# EAGLE design dual-dac-w-32-ch-sh-SH-BOARD v2 (EAGLE 7.2.0)
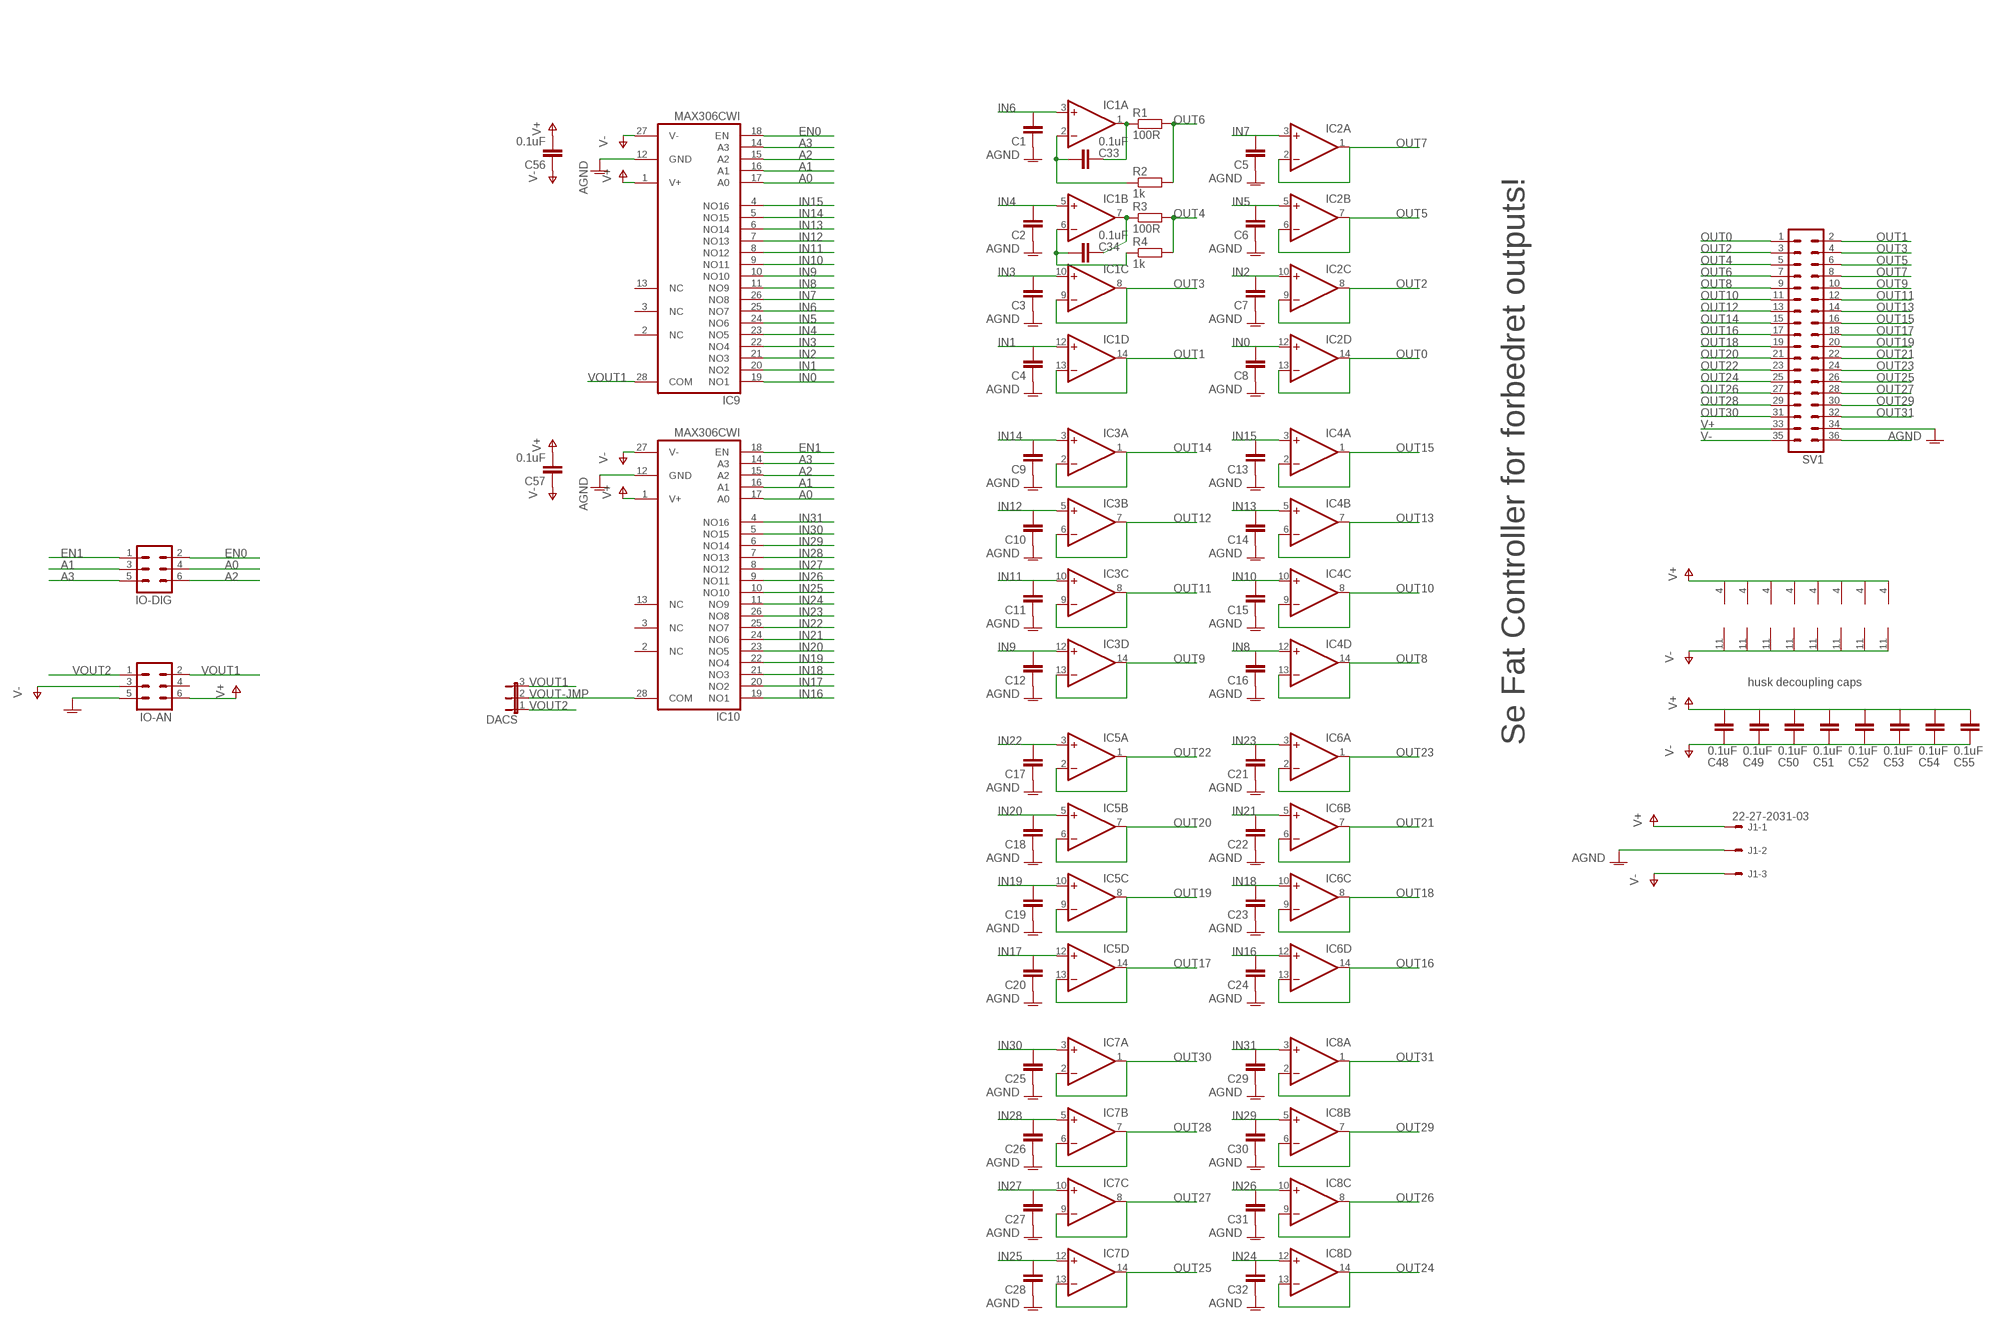
[diagram p0: schematic, sheet 1]

## Parts
C1  C-EUC1206  [C1206]
C2  C-EUC1206  [C1206]
C3  C-EUC1206  [C1206]
C4  C-EUC1206  [C1206]
C5  C-EUC1206  [C1206]
C6  C-EUC1206  [C1206]
C7  C-EUC1206  [C1206]
C8  C-EUC1206  [C1206]
C9  C-EUC1206  [C1206]
C10  C-EUC1206  [C1206]
C11  C-EUC1206  [C1206]
C12  C-EUC1206  [C1206]
C13  C-EUC1206  [C1206]
C14  C-EUC1206  [C1206]
C15  C-EUC1206  [C1206]
C16  C-EUC1206  [C1206]
C17  C-EUC1206  [C1206]
C18  C-EUC1206  [C1206]
C19  C-EUC1206  [C1206]
C20  C-EUC1206  [C1206]
C21  C-EUC1206  [C1206]
C22  C-EUC1206  [C1206]
C23  C-EUC1206  [C1206]
C24  C-EUC1206  [C1206]
C25  C-EUC1206  [C1206]
C26  C-EUC1206  [C1206]
C27  C-EUC1206  [C1206]
C28  C-EUC1206  [C1206]
C29  C-EUC1206  [C1206]
C30  C-EUC1206  [C1206]
C31  C-EUC1206  [C1206]
C32  C-EUC1206  [C1206]
C33  0.1uF  C-EUC0603  [C0603]
C34  0.1uF  C-EUC0603  [C0603]
C48  0.1uF  C-EUC0603  [C0603]
C49  0.1uF  C-EUC0603  [C0603]
C50  0.1uF  C-EUC0603  [C0603]
C51  0.1uF  C-EUC0603  [C0603]
C52  0.1uF  C-EUC0603  [C0603]
C53  0.1uF  C-EUC0603  [C0603]
C54  0.1uF  C-EUC0603  [C0603]
C55  0.1uF  C-EUC0603  [C0603]
C56  0.1uF  C-EUC0603  [C0603]
C57  0.1uF  C-EUC0603  [C0603]
DACS  JP2E  [JP2]
IC1  TL074D  [SO14]
IC2  TL074D  [SO14]
IC3  TL074D  [SO14]
IC4  TL074D  [SO14]
IC5  TL074D  [SO14]
IC6  TL074D  [SO14]
IC7  TL074D  [SO14]
IC8  TL074D  [SO14]
IC9  MAX306CWI  [SO28L]
IC10  MAX306CWI  [SO28L]
IO-AN  MA03-2  [MA03-2]
IO-DIG  MA03-2  [MA03-2]
J1  22-27-2031-03  [6410-03]
R1  100R  R-EU_R0603  [R0603]
R2  1k  R-EU_R0603  [R0603]
R3  100R  R-EU_R0603  [R0603]
R4  1k  R-EU_R0603  [R0603]
SV1  MA18-2  [MA18-2]

## Nets
A0: IC9.17(A0) IC10.17(A0) IO-DIG.4
A1: IC9.16(A1) IC10.16(A1) IO-DIG.3
A2: IC9.15(A2) IC10.15(A2) IO-DIG.6
A3: IC9.14(A3) IC10.14(A3) IO-DIG.5
AGND: C1.1 C2.1 C3.1 C4.1 C5.1 C6.1 C7.1 C8.1 C9.1 C10.1 C11.1 C12.1 C13.1 C14.1 C15.1 C16.1 C17.1 C18.1 C19.1 C20.1 C21.1 C22.1 C23.1 C24.1 C25.1 C26.1 C27.1 C28.1 C29.1 C30.1 C31.1 C32.1 IC9.12(GND) IC10.12(GND) IO-AN.5 J1.2 SV1.34
EN0: IC9.18(EN) IO-DIG.2
EN1: IC10.18(EN) IO-DIG.1
IN0: C8.2 IC2.12(D:+IN) IC9.19(NO1)
IN1: C4.2 IC1.12(D:+IN) IC9.20(NO2)
IN2: C7.2 IC2.10(C:+IN) IC9.21(NO3)
IN3: C3.2 IC1.10(C:+IN) IC9.22(NO4)
IN4: C2.2 IC1.5(B:+IN) IC9.23(NO5)
IN5: C6.2 IC2.5(B:+IN) IC9.24(NO6)
IN6: C1.2 IC1.3(A:+IN) IC9.25(NO7)
IN7: C5.2 IC2.3(A:+IN) IC9.26(NO8)
IN8: C16.2 IC4.12(D:+IN) IC9.11(NO9)
IN9: C12.2 IC3.12(D:+IN) IC9.10(NO10)
IN10: C15.2 IC4.10(C:+IN) IC9.9(NO11)
IN11: C11.2 IC3.10(C:+IN) IC9.8(NO12)
IN12: C10.2 IC3.5(B:+IN) IC9.7(NO13)
IN13: C14.2 IC4.5(B:+IN) IC9.6(NO14)
IN14: C9.2 IC3.3(A:+IN) IC9.5(NO15)
IN15: C13.2 IC4.3(A:+IN) IC9.4(NO16)
IN16: C24.2 IC6.12(D:+IN) IC10.19(NO1)
IN17: C20.2 IC5.12(D:+IN) IC10.20(NO2)
IN18: C23.2 IC6.10(C:+IN) IC10.21(NO3)
IN19: C19.2 IC5.10(C:+IN) IC10.22(NO4)
IN20: C18.2 IC5.5(B:+IN) IC10.23(NO5)
IN21: C22.2 IC6.5(B:+IN) IC10.24(NO6)
IN22: C17.2 IC5.3(A:+IN) IC10.25(NO7)
IN23: C21.2 IC6.3(A:+IN) IC10.26(NO8)
IN24: C32.2 IC8.12(D:+IN) IC10.11(NO9)
IN25: C28.2 IC7.12(D:+IN) IC10.10(NO10)
IN26: C31.2 IC8.10(C:+IN) IC10.9(NO11)
IN27: C27.2 IC7.10(C:+IN) IC10.8(NO12)
IN28: C26.2 IC7.5(B:+IN) IC10.7(NO13)
IN29: C30.2 IC8.5(B:+IN) IC10.6(NO14)
IN30: C25.2 IC7.3(A:+IN) IC10.5(NO15)
IN31: C29.2 IC8.3(A:+IN) IC10.4(NO16)
N$1: C33.2 IC1.2(A:-IN) R2.1
N$2: C33.1 IC1.1(A:OUT) R1.1
N$3: C34.1 IC1.7(B:OUT) R3.1
N$4: SV1.36
N$5: C34.2 IC1.6(B:-IN) R4.1
OUT0: IC2.13(D:-IN) IC2.14(D:OUT) SV1.1
OUT1: IC1.13(D:-IN) IC1.14(D:OUT) SV1.2
OUT2: IC2.8(C:OUT) IC2.9(C:-IN) SV1.3
OUT3: IC1.8(C:OUT) IC1.9(C:-IN) SV1.4
OUT4: R3.2 R4.2 SV1.5
OUT5: IC2.6(B:-IN) IC2.7(B:OUT) SV1.6
OUT6: R1.2 R2.2 SV1.7
OUT7: IC2.1(A:OUT) IC2.2(A:-IN) SV1.8
OUT8: IC4.13(D:-IN) IC4.14(D:OUT) SV1.9
OUT9: IC3.13(D:-IN) IC3.14(D:OUT) SV1.10
OUT10: IC4.8(C:OUT) IC4.9(C:-IN) SV1.11
OUT11: IC3.8(C:OUT) IC3.9(C:-IN) SV1.12
OUT12: IC3.6(B:-IN) IC3.7(B:OUT) SV1.13
OUT13: IC4.6(B:-IN) IC4.7(B:OUT) SV1.14
OUT14: IC3.1(A:OUT) IC3.2(A:-IN) SV1.15
OUT15: IC4.1(A:OUT) IC4.2(A:-IN) SV1.16
OUT16: IC6.13(D:-IN) IC6.14(D:OUT) SV1.17
OUT17: IC5.13(D:-IN) IC5.14(D:OUT) SV1.18
OUT18: IC6.8(C:OUT) IC6.9(C:-IN) SV1.19
OUT19: IC5.8(C:OUT) IC5.9(C:-IN) SV1.20
OUT20: IC5.6(B:-IN) IC5.7(B:OUT) SV1.21
OUT21: IC6.6(B:-IN) IC6.7(B:OUT) SV1.22
OUT22: IC5.1(A:OUT) IC5.2(A:-IN) SV1.23
OUT23: IC6.1(A:OUT) IC6.2(A:-IN) SV1.24
OUT24: IC8.13(D:-IN) IC8.14(D:OUT) SV1.25
OUT25: IC7.13(D:-IN) IC7.14(D:OUT) SV1.26
OUT26: IC8.8(C:OUT) IC8.9(C:-IN) SV1.27
OUT27: IC7.8(C:OUT) IC7.9(C:-IN) SV1.28
OUT28: IC7.6(B:-IN) IC7.7(B:OUT) SV1.29
OUT29: IC8.6(B:-IN) IC8.7(B:OUT) SV1.30
OUT30: IC7.1(A:OUT) IC7.2(A:-IN) SV1.31
OUT31: IC8.1(A:OUT) IC8.2(A:-IN) SV1.32
V+: C48.2 C49.2 C50.2 C51.2 C52.2 C53.2 C54.2 C55.2 C56.2 C57.2 IC1.4(P:V+) IC2.4(P:V+) IC3.4(P:V+) IC4.4(P:V+) IC5.4(P:V+) IC6.4(P:V+) IC7.4(P:V+) IC8.4(P:V+) IC9.1(V+) IC10.1(V+) IO-AN.6 J1.1 SV1.33
V-: C48.1 C49.1 C50.1 C51.1 C52.1 C53.1 C54.1 C55.1 C56.1 C57.1 IC1.11(P:V-) IC2.11(P:V-) IC3.11(P:V-) IC4.11(P:V-) IC5.11(P:V-) IC6.11(P:V-) IC7.11(P:V-) IC8.11(P:V-) IC9.27(V-) IC10.27(V-) IO-AN.3 J1.3 SV1.35
VOUT1: DACS.3 IC9.28(COM) IO-AN.2
VOUT2: DACS.1 IO-AN.1
VOUT-JMP: DACS.2 IC10.28(COM)
Unconnected: IC9.2(NC) IC9.3(NC) IC9.13(NC) IC10.2(NC) IC10.3(NC) IC10.13(NC) IO-AN.4

## Notes on the sheet
- husk decoupling caps
- Se Fat Controller for forbedret outputs!

## Library data of the parts
C1-C34 C48-C57 = resistor:C-EU: CAPACITOR, European symbol
DACS = jumper:JP2E: JUMPER
IC1-IC8 = linear:TL074: OP AMP
IC9 IC10 = maxim:MAX306CWI: MULTIPLEXER; MF: MAXIM; MPN: MAX306CWI; OC_FARNELL: unknown; OC_NEWARK: 90C2555
IO-AN IO-DIG = con-lstb:MA03-2: PIN HEADER; OC_FARNELL: unknown; OC_NEWARK: unknown
J1 = con-molex:22-?-03: CONNECTOR wire to board 2.54 mm (.1 inch) pitch header; OC_FARNELL: unknown; OC_NEWARK: unknown
R1-R4 = resistor:R-EU_: RESISTOR, European symbol
SV1 = con-lstb:MA18-2: PIN HEADER; OC_FARNELL: unknown; OC_NEWARK: unknown

## Board
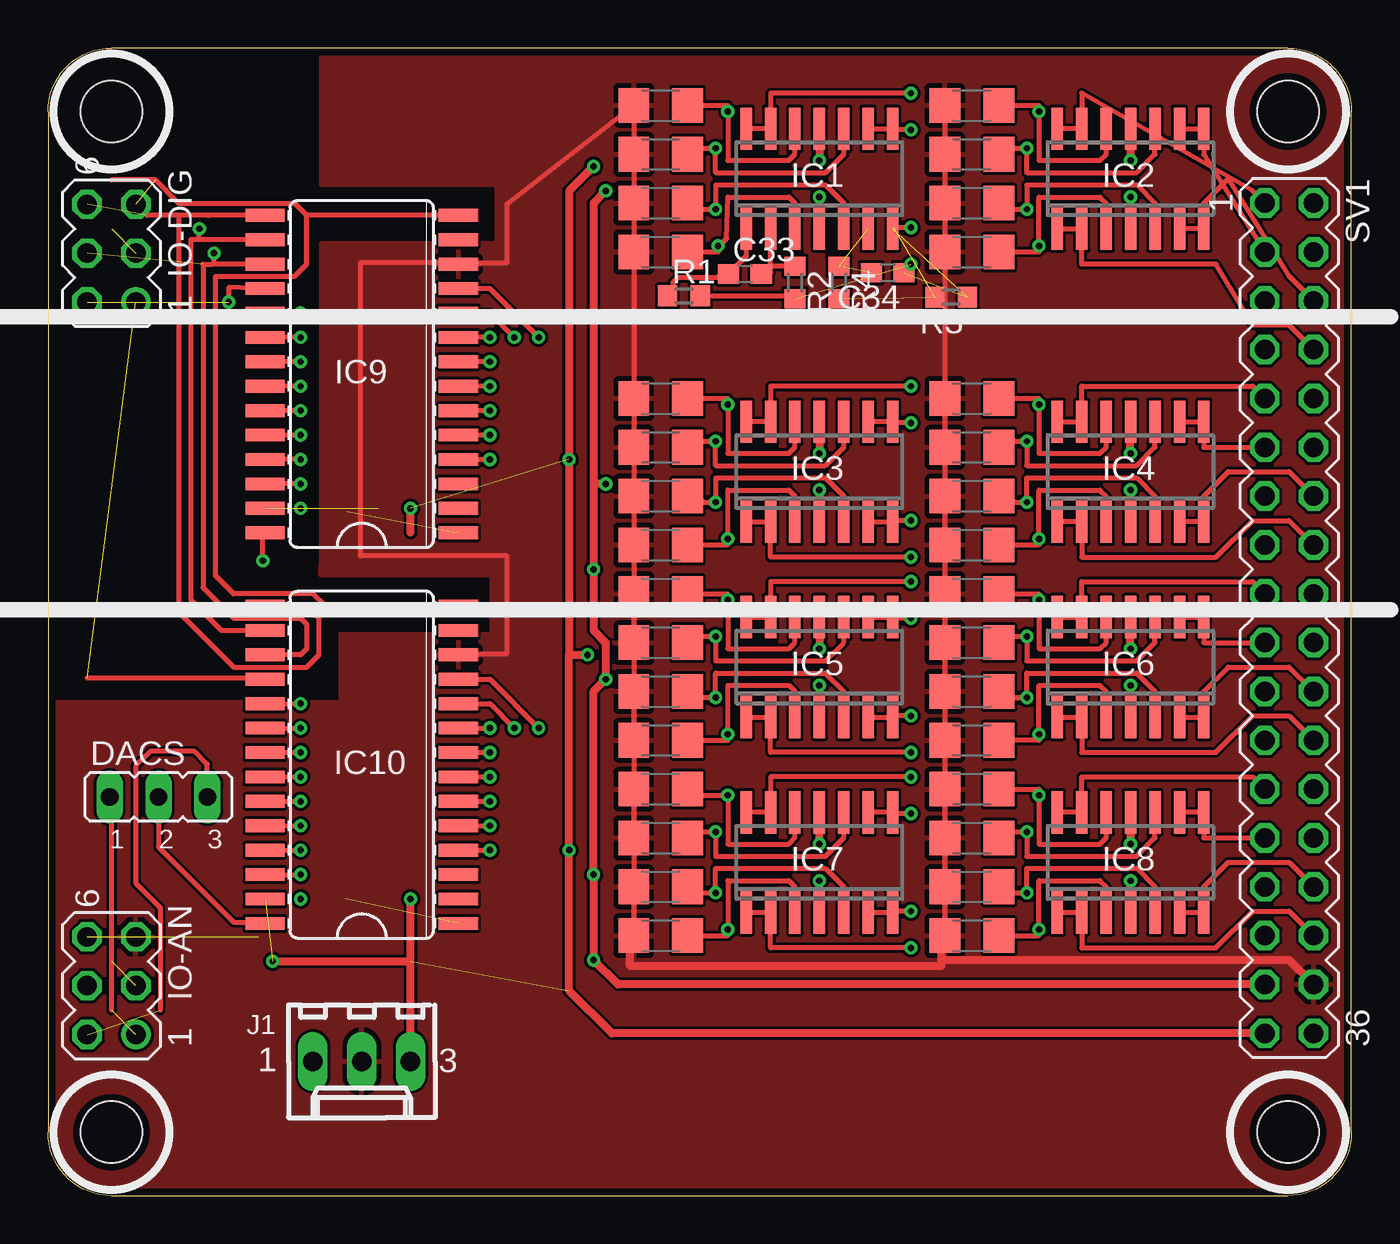
[diagram p1: board, top side]
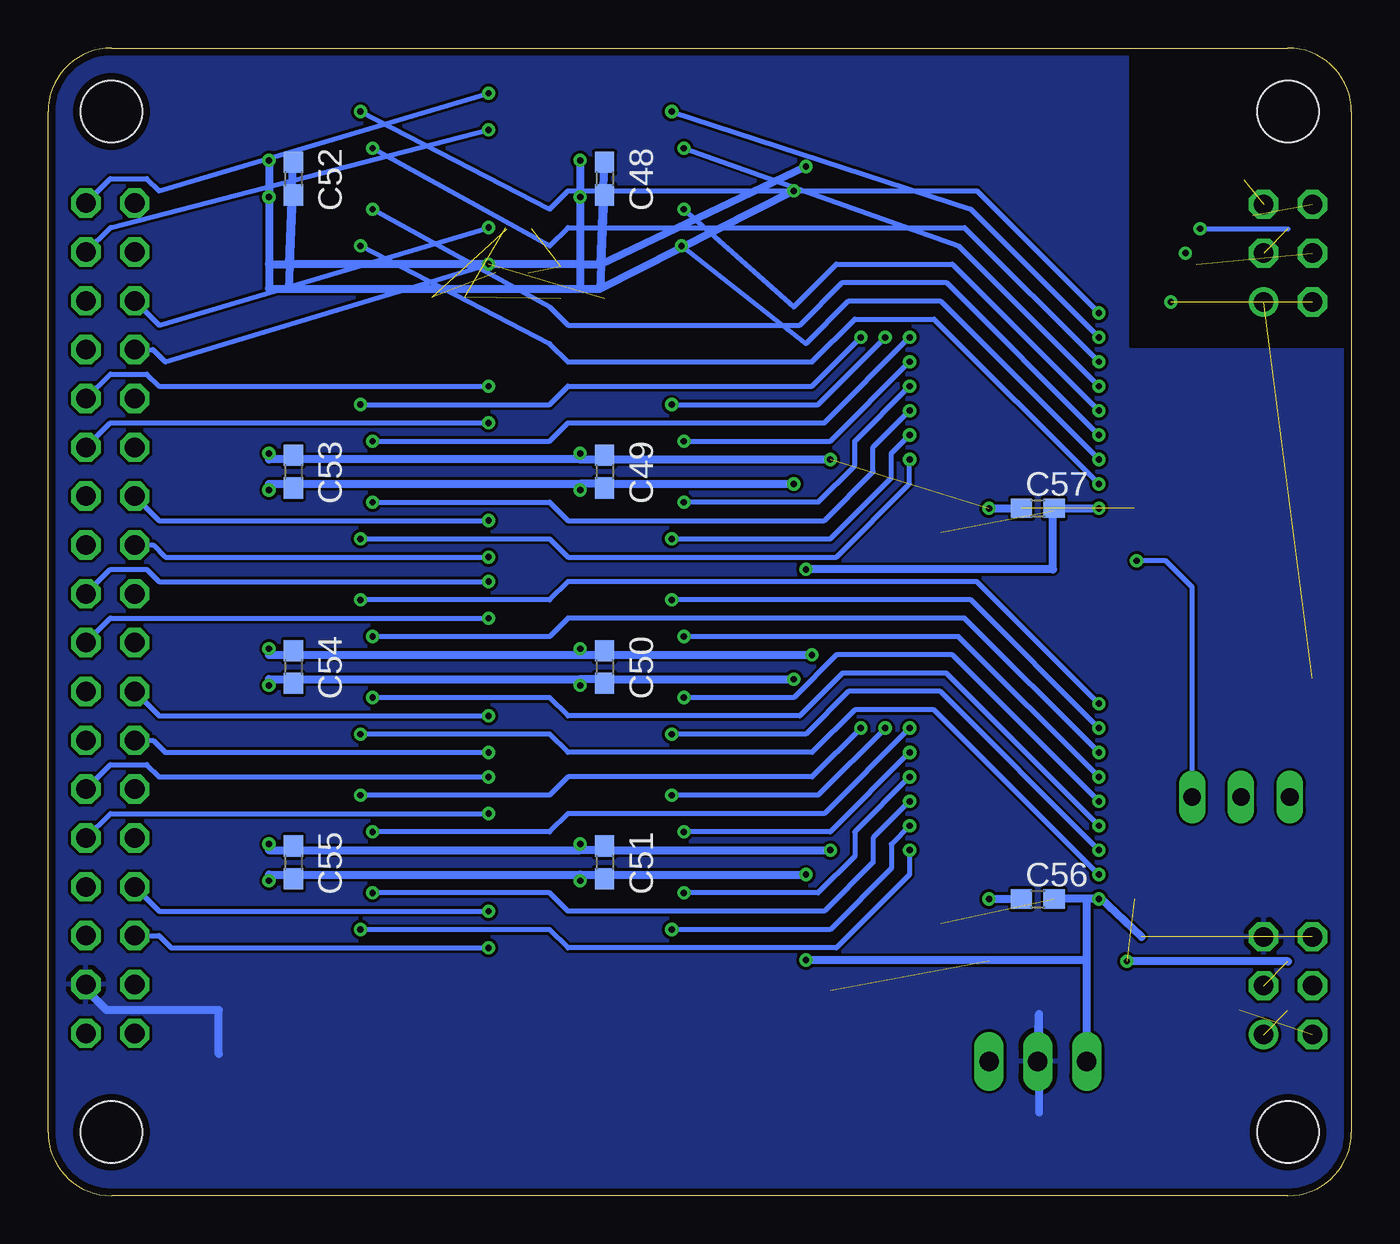
[diagram p2: board, bottom side, seen from below]

Size 67.82 x 59.69 mm. Coordinates in mm from the lower left corner, seen from the top.
Outline: 3.3,0 64.52,0 arc90 67.82,3.3 67.82,56.39 arc90 64.52,59.69 3.3,59.69 arc90 0,56.39 0,3.3 arc90 3.3,0
Copper layers (1*16): Top 0.0356mm / dielectric 1.5011mm / Bottom 0.0356mm
Design rules "LaenPCBOrder": minimum track width 6mil, minimum drill 13mil, track to track 6mil, track to pad 6mil, pad to pad 6mil, via to via 6mil, smd to smd 6mil, copper to edge 15mil, drill to drill 6mil, minimum pad ring 7mil, minimum via ring 7mil, stop-mask expansion 3mil, vias tented up to drill 0mil, thermal gap 10mil
Holes 3.2 mm at 3.3,56.39 64.52,56.39 64.52,3.3 3.3,3.3

### Footprints (pad centres in the part's own frame; a part is rotated, then mirrored left to right if it is on the bottom)
C1206 = smd 1.6 x 1.8: 1 -1.4,0; 2 1.4,0
C0603 = smd 1.1 x 1: 1 -0.85,0; 2 0.85,0
JP2 = drill 0.914 long: 1 -2.54,0; 2 0,0; 3 2.54,0
SO14 = smd 0.6 x 2.2: 1 -3.81,-2.6; 2 -2.54,-2.6; 3 -1.27,-2.6; 4 0,-2.6; 5 1.27,-2.6; 6 2.54,-2.6; 7 3.81,-2.6; 8 3.81,2.6; 9 2.54,2.6; 10 1.27,2.6; 11 0,2.6; 12 -1.27,2.6; 13 -2.54,2.6; 14 -3.81,2.6
SO28L = smd 0.66 x 2.032: 1 -8.255,-5.029; 2 -6.985,-5.029; 3 -5.715,-5.029; 4 -4.445,-5.029; 5 -3.175,-5.029; 6 -1.905,-5.029; 7 -0.635,-5.029; 8 0.635,-5.029; 9 1.905,-5.029; 10 3.175,-5.029; 11 4.445,-5.029; 12 5.715,-5.029; 13 6.985,-5.029; 14 8.255,-5.029; 15 8.255,5.029; 16 6.985,5.029; 17 5.715,5.029; 18 4.445,5.029; 19 3.175,5.029; 20 1.905,5.029; 21 0.635,5.029; 22 -0.635,5.029; 23 -1.905,5.029; 24 -3.175,5.029; 25 -4.445,5.029; 26 -5.715,5.029; 27 -6.985,5.029; 28 -8.255,5.029
MA03-2 = drill 1.016: 1 -2.54,-1.27 | drill 1.016 octagon: 2 -2.54,1.27; 3 0,-1.27; 4 0,1.27; 5 2.54,-1.27; 6 2.54,1.27
6410-03 = drill 1.016 long: 1 2.54,0; 2 0,0; 3 -2.54,0
R0603 = smd 1 x 1.1: 1 -0.85,0; 2 0.85,0
MA18-2 = drill 1.016 octagon: 1 -21.59,-1.27; 2 -21.59,1.27; 3 -19.05,-1.27; 4 -19.05,1.27; 5 -16.51,-1.27; 6 -16.51,1.27; 7 -13.97,-1.27; 8 -13.97,1.27; 9 -11.43,-1.27; 10 -11.43,1.27; 11 -8.89,-1.27; 12 -8.89,1.27; 13 -6.35,-1.27; 14 -6.35,1.27; 15 -3.81,-1.27; 16 -3.81,1.27; 17 -1.27,-1.27; 18 -1.27,1.27; 19 1.27,-1.27; 20 1.27,1.27; 21 3.81,-1.27; 22 3.81,1.27; 23 6.35,-1.27; 24 6.35,1.27; 25 8.89,-1.27; 26 8.89,1.27; 27 11.43,-1.27; 28 11.43,1.27; 29 13.97,-1.27; 30 13.97,1.27; 31 16.51,-1.27; 32 16.51,1.27; 33 19.05,-1.27; 34 19.05,1.27; 35 21.59,-1.27; 36 21.59,1.27

### Placement (x,y rotation side)
C1  31.88,49.09 0 top
C2  31.88,51.63 0 top
C3  31.88,54.17 0 top
C4  31.88,56.71 0 top
C5  48.07,49.09 0 top
C6  48.07,51.63 0 top
C7  48.07,54.17 0 top
C8  48.07,56.71 0 top
C9  31.88,33.85 0 top
C10  31.88,36.39 0 top
C11  31.88,38.93 0 top
C12  31.88,41.47 0 top
C13  48.07,33.85 0 top
C14  48.07,36.39 0 top
C15  48.07,38.93 0 top
C16  48.07,41.47 0 top
C17  31.88,23.69 0 top
C18  31.88,26.23 0 top
C19  31.88,28.77 0 top
C20  31.88,31.31 0 top
C21  48.07,23.69 0 top
C22  48.07,26.23 0 top
C23  48.07,28.77 0 top
C24  48.07,31.31 0 top
C25  31.88,13.53 0 top
C26  31.88,16.07 0 top
C27  31.88,18.61 0 top
C28  31.88,21.15 0 top
C29  48.07,13.53 0 top
C30  48.07,16.07 0 top
C31  48.07,18.61 0 top
C32  48.07,21.15 0 top
C33  36.26,47.94 0 top
C34  43.69,48.01 180 top
C48  38.86,52.9 270 bottom
C49  38.86,37.66 270 bottom
C50  38.86,27.5 270 bottom
C51  38.86,17.34 270 bottom
C52  55.05,52.9 270 bottom
C53  55.05,37.66 270 bottom
C54  55.05,27.5 270 bottom
C55  55.05,17.34 270 bottom
C56  16.32,15.43 0 bottom
C57  16.32,35.75 0 bottom
DACS  5.75,20.73 0 top
IC1  40.13,52.9 0 top
IC2  56.32,52.9 0 top
IC3  40.13,37.66 0 top
IC4  56.32,37.66 0 top
IC5  40.13,27.5 0 top
IC6  56.32,27.5 0 top
IC7  40.13,17.34 0 top
IC8  56.32,17.34 0 top
IC9  16.32,42.74 90 top
IC10  16.32,22.42 90 top
IO-AN  3.3,10.92 90 top
IO-DIG  3.3,49.02 90 top
J1  16.32,6.99 180 top
R1  33.08,46.8 0 top
R2  38.86,47.5 270 top
R3  46.99,46.74 180 top
R4  41.15,47.5 270 top
SV1  64.58,30.04 270 top

### Tracks (layer width: path | path; a pad name or v marks a point on that pad's centre or on a via)
A0  (via drill 0.33)  (1 unrouted)
  Top 0.254: IC9.17 8.57,48.45 | IC10.17 13.14,28.13 13.46,28.45 13.46,29.72 13.14,30.04 9.65,30.04 8.06,31.62 8.06,48.45 8.57,48.45 | 8.57,48.45 8.64,48.51 v8.64,49.02
A1  (via drill 0.33)  (1 unrouted)
  Top 0.254: IC9.16 7.87,49.72 | 7.87,49.72 7.43,49.72 7.43,30.99 9.02,29.4 IC10.16 | 7.87,49.72 v7.87,50.29
  Bottom 0.254: v7.87,50.29 3.3,50.29
A2  (1 unrouted)
  Top 0.254: 8.38,50.99 IC9.15 6.79,50.99 | 6.79,50.99 6.79,30.35 9.65,27.5 13.46,27.5 14.1,28.13 14.1,30.04 13.46,30.67 IC10.15 | 6.79,50.99 5.14,50.99
A3  (1 unrouted)
  Top 0.254: IC9.14 13.46,50.99 | IC10.14 14.41,30.67 13.78,31.3 9.65,31.3 8.7,32.26 8.7,47.82 12.83,47.82 13.46,48.45 13.46,50.99 | 13.46,50.99 12.83,51.63 6.79,51.63 5.59,52.83 3.3,52.83
AGND
  Top 0.254: C8.1 C7.1 C6.1 C5.1 C15.1 C16.1 C13.1 C14.1 C22.1 C23.1 C24.1 C21.1 C30.1 C31.1 C29.1 C32.1 | C26.1 C25.1 C28.1 C27.1 C18.1 C17.1 C20.1 C19.1 C9.1 C10.1 C11.1 C12.1 C1.1 C2.1 C3.1 C4.1 23.94,51.63 23.88,51.56 23.88,48.51 21.41,48.51 IC9.12 21.29,48.51 16.26,48.51 16.26,33.27 23.88,33.27 23.88,28.19 21.41,28.19 IC10.12
  Top 0.406: SV1.34 64.58,12.26 46.48,12.26 | 46.48,12.26 46.48,11.94 30.29,11.94 30.29,13.34 C25.1 | 46.48,12.26 46.48,13.34 C29.1 | J1.2 16.32,7.43
  Bottom 0.406: J1.2 16.26,9.46 16.26,4.32 | 58.93,7.37 58.93,9.65 64.77,9.65 65.85,10.73 SV1.34
  pour Top: -0.76,25.65 15.24,25.65 15.24,29.21 23.11,29.21 23.11,32.26 14.33,32.26 arc-45 14.15,32.33 14.22,33.02 14.22,49.53 23.37,49.53 23.37,52.58 14.22,52.58 14.22,60.2 66.19,60.2 arc-45 66.37,60.12 68.33,58.17 68.33,1.63 arc-45 68.25,1.45 66.55,-0.25 1.63,-0.25 arc-45 1.45,-0.18 -0.76,2.03
  pour Bottom: -0.76,43.94 11.68,43.94 11.68,60.2 68.73,60.2 arc-45 68.91,60.12 69.09,59.94 69.09,-0.4 arc45 69.16,-0.58 69.34,-0.76 0.61,-0.76 arc-45 0.43,-0.69 -1.02,0.76 -1.02,43.58 arc-45 -0.94,43.76
EN0  (via drill 0.33)  (1 unrouted)
  Top 0.254: IC9.18 9.4,47.24 v9.4,46.48
EN1  (1 unrouted)
  Top 0.254: IC10.18 11.23,26.92 2.03,26.92
IN0  (via drill 0.33)
  Top 0.254: IC2.12 55.05,54.17 54.74,53.85 51.56,53.85 v51.56,56.39 51.56,56.71 C8.2 | IC9.19 v13.14,45.91
  Bottom 0.254: v51.56,56.39 41.72,51.31 40.77,52.26 19.49,52.26 v13.14,45.91
IN1  (via drill 0.33)
  Top 0.254: IC1.12 38.86,54.17 38.54,53.85 35.37,53.85 v35.37,56.39 35.37,56.71 C4.2 | v13.14,44.64 IC9.20
  Bottom 0.254: v35.37,56.39 19.81,51.31 v13.14,44.64
IN2  (via drill 0.33)
  Top 0.254: C7.2 50.1,54.03 49.97,54.17 50.29,54.48 v50.93,54.48 50.93,53.21 56.64,53.21 57.59,54.17 IC2.10 | v13.14,43.37 IC9.21
  Bottom 0.254: v50.93,54.48 41.72,49.4 40.77,50.35 20.13,50.35 v13.14,43.37
IN3  (via drill 0.33)
  Top 0.254: IC1.10 41.4,54.17 40.45,53.21 34.73,53.21 v34.73,54.48 33.59,54.48 C3.2 | v13.14,42.1 IC9.22
  Bottom 0.254: v34.73,54.48 20.45,49.4 v13.14,42.1
IN4  (via drill 0.33)
  Top 0.254: 33.91,51.76 C2.2 33.59,51.31 v34.73,51.31 34.73,52.58 40.45,52.58 41.4,51.63 IC1.5 | v13.14,40.83 IC9.23
  Bottom 0.254: v34.73,51.31 29.02,46.23 26.8,48.45 20.77,48.45 v13.14,40.83
IN5  (via drill 0.33)
  Top 0.254: 50.1,51.76 C6.2 49.79,51.31 v50.93,51.31 50.93,52.58 56.64,52.58 57.59,51.63 IC2.5 | v13.14,39.56 IC9.24
  Bottom 0.254: v50.93,51.31 41.72,46.23 40.77,45.28 28.7,45.28 26.48,47.5 21.08,47.5 v13.14,39.56
IN6  (via drill 0.33)
  Top 0.254: IC1.3 38.86,51.63 38.54,51.94 35.37,51.94 35.31,49.78 34.92,49.4 v34.86,49.4 34.86,49.09 C1.2 | v13.14,38.29 IC9.25
  Bottom 0.254: v34.86,49.4 28.38,44.32 26.16,46.55 21.4,46.55 v13.14,38.29
IN7  (via drill 0.33)
  Top 0.254: IC2.3 55.05,51.63 54.74,51.94 51.56,51.94 v51.56,49.4 51.56,49.09 C5.2 | v13.14,37.02 IC9.26
  Bottom 0.254: v51.56,49.4 41.72,44.32 40.77,43.37 28.07,43.37 25.84,45.59 21.72,45.59 v13.14,37.02
IN8  (via drill 0.33)
  Top 0.254: IC4.12 55.05,38.92 54.74,38.61 51.56,38.61 v51.56,41.15 51.56,41.47 C16.2 | v25.53,44.64 22.99,47.18 IC9.11
  Bottom 0.254: v51.56,41.15 41.72,41.15 40.77,42.1 28.07,42.1 v25.53,44.64
IN9  (via drill 0.33)
  Top 0.254: IC3.12 38.86,38.92 38.54,38.61 35.37,38.61 v35.37,41.15 35.37,41.47 C12.2 | v24.26,44.64 22.99,45.91 IC9.10
  Bottom 0.254: v35.37,41.15 27.75,41.15 v24.26,44.64
IN10  (via drill 0.33)
  Top 0.254: IC4.10 57.59,38.92 56.64,37.97 50.93,37.97 v50.93,39.24 50.29,39.24 49.97,38.92 C15.2 | v22.99,44.64 IC9.9
  Bottom 0.254: v50.93,39.24 41.72,39.24 40.77,40.2 27.43,40.2 v22.99,44.64
IN11  (via drill 0.33)
  Top 0.254: IC3.10 41.4,38.92 40.45,37.97 34.73,37.97 v34.73,39.24 34.1,39.24 C11.2 | v22.99,43.37 IC9.8
  Bottom 0.254: v34.73,39.24 27.11,39.24 v22.99,43.37
IN12  (via drill 0.33)
  Top 0.254: IC3.5 41.4,36.39 40.45,37.34 34.73,37.34 v34.73,36.07 34.1,36.07 33.78,36.39 C10.2 | v22.99,42.1 IC9.7
  Bottom 0.254: v34.73,36.07 27.75,36.07 25.84,37.97 25.84,39.24 v22.99,42.1
IN13  (via drill 0.33)
  Top 0.254: IC4.5 57.59,36.39 56.64,37.34 50.93,37.34 v50.93,36.07 50.29,36.07 49.97,36.39 C14.2 | v22.99,40.83 IC9.6
  Bottom 0.254: v50.93,36.07 41.72,36.07 40.77,35.12 27.43,35.12 24.89,37.66 24.89,38.92 v22.99,40.83
IN14  (via drill 0.33)
  Top 0.254: IC3.3 38.86,36.39 38.54,36.7 35.37,36.7 v35.37,34.16 35.37,33.85 C9.2 | v22.99,39.56 IC9.5
  Bottom 0.254: v35.37,34.16 27.11,34.16 23.94,37.34 23.94,38.61 v22.99,39.56
IN15  (via drill 0.33)
  Top 0.254: IC4.3 55.05,36.39 54.74,36.7 51.56,36.7 v51.56,34.16 51.56,33.85 C13.2 | IC9.4 v22.99,38.29
  Bottom 0.254: v51.56,34.16 41.72,34.16 40.77,33.21 26.8,33.21 22.99,37.02 v22.99,38.29
IN16  (via drill 0.33)
  Top 0.254: IC6.12 55.05,28.77 54.74,28.45 51.56,28.45 v51.56,30.99 51.56,31.3 C24.2 | IC10.19 v13.14,25.59
  Bottom 0.254: v13.14,25.59 19.49,31.94 40.77,31.94 41.72,30.99 v51.56,30.99
IN17  (via drill 0.33)
  Top 0.254: IC5.12 38.86,28.77 38.54,28.45 35.37,28.45 v35.37,30.99 35.37,31.3 C20.2 | IC10.20 v13.14,24.32
  Bottom 0.254: v13.14,24.32 19.81,30.99 v35.37,30.99
IN18  (via drill 0.33)
  Top 0.254: IC6.10 57.59,28.77 56.64,27.81 50.93,27.81 v50.93,29.08 49.97,29.08 49.66,28.77 C23.2 | IC10.21 v13.14,23.05
  Bottom 0.254: v13.14,23.05 20.13,30.04 40.77,30.04 41.72,29.08 v50.93,29.08
IN19  (via drill 0.33)
  Top 0.254: IC5.10 41.4,28.77 40.45,27.81 34.73,27.81 v34.73,29.08 33.78,29.08 33.47,28.77 C19.2 | IC10.22 v13.14,21.78
  Bottom 0.254: v13.14,21.78 20.45,29.08 v34.73,29.08
IN20  (via drill 0.33)
  Top 0.254: IC10.23 v13.14,20.51 | C18.2 33.59,25.91 v34.73,25.91 34.73,27.18 40.45,27.18 41.4,26.23 IC5.5
  Bottom 0.254: v13.14,20.51 20.77,28.13 26.8,28.13 29.02,25.91 v34.73,25.91
IN21  (via drill 0.33)
  Top 0.254: IC10.24 v13.14,19.24 | v50.93,25.91 49.79,25.91 C22.2 49.47,26.1 49.66,25.91 v50.93,25.91 | v50.93,25.91 50.93,27.18 56.64,27.18 57.59,26.23 IC6.5
  Bottom 0.254: v13.14,19.24 21.08,27.18 26.48,27.18 28.7,24.96 40.77,24.96 41.72,25.91 v50.93,25.91
IN22  (via drill 0.33)
  Top 0.254: IC5.3 38.86,26.23 38.54,26.54 35.37,26.54 v35.37,24 35.37,23.69 C17.2 | IC10.25 v13.14,17.97
  Bottom 0.254: v13.14,17.97 21.4,26.23 26.16,26.23 28.38,24 v35.37,24
IN23  (via drill 0.33)
  Top 0.254: IC6.3 55.05,26.23 54.74,26.54 51.56,26.54 v51.56,24 51.56,23.69 C21.2 | IC10.26 v13.14,16.7
  Bottom 0.254: v13.14,16.7 21.72,25.27 25.84,25.27 28.07,23.05 40.77,23.05 41.72,24 v51.56,24
IN24  (via drill 0.33)
  Top 0.254: IC8.12 55.05,18.61 54.74,18.29 51.56,18.29 v51.56,20.83 51.56,21.14 C32.2 | IC10.11 22.99,26.86 v25.53,24.32
  Bottom 0.254: v25.53,24.32 28.07,21.78 40.77,21.78 41.72,20.83 v51.56,20.83
IN25  (via drill 0.33)
  Top 0.254: IC7.12 38.86,18.61 38.54,18.29 35.37,18.29 v35.37,20.83 33.78,20.83 | IC10.10 22.99,25.59 v24.26,24.32 | 33.78,20.83 33.59,20.83 C28.2 33.47,21.14 33.78,20.83
  Bottom 0.254: v24.26,24.32 27.75,20.83 v35.37,20.83
IN26  (via drill 0.33)
  Top 0.254: IC8.10 57.59,18.61 56.64,17.65 50.93,17.65 v50.93,18.92 49.97,18.92 49.66,18.61 C31.2 | IC10.9 v22.99,24.32
  Bottom 0.254: v22.99,24.32 27.43,19.88 40.77,19.88 41.72,18.92 v50.93,18.92
IN27  (via drill 0.33)
  Top 0.254: IC7.10 41.4,18.61 40.45,17.65 34.73,17.65 v34.73,18.92 33.78,18.92 | IC10.8 v22.99,23.05 | 33.78,18.92 33.59,18.92 C27.2 33.47,18.61 33.78,18.92
  Bottom 0.254: v22.99,23.05 27.11,18.92 v34.73,18.92
IN28  (via drill 0.33)
  Top 0.254: IC7.5 41.4,16.07 40.45,17.02 34.73,17.02 v34.73,15.75 33.78,15.75 | IC10.7 v22.99,21.78 | 33.78,15.75 33.59,15.75 C26.2 33.47,16.07 33.78,15.75
  Bottom 0.254: v22.99,21.78 25.84,18.92 25.84,17.65 27.75,15.75 v34.73,15.75
IN29  (via drill 0.33)
  Top 0.254: IC8.5 57.59,16.07 56.64,17.02 50.93,17.02 v50.93,15.75 49.97,15.75 | IC10.6 v22.99,20.51 | 49.97,15.75 49.79,15.75 C30.2 49.66,16.07 49.97,15.75
  Bottom 0.254: v22.99,20.51 24.89,18.61 24.89,17.34 27.43,14.8 40.77,14.8 41.72,15.75 v50.93,15.75
IN30  (via drill 0.33)
  Top 0.254: IC7.3 38.86,16.07 38.54,16.38 35.37,16.38 v35.37,13.84 35.37,13.53 C25.2 | IC10.5 v22.99,19.24
  Bottom 0.254: v22.99,19.24 23.94,18.29 23.94,17.02 27.11,13.84 v35.37,13.84
IN31  (via drill 0.33)
  Top 0.254: IC8.3 55.05,16.07 54.74,16.38 51.56,16.38 v51.56,13.84 51.56,13.53 C29.2 | IC10.4 v22.99,17.97
  Bottom 0.254: v22.99,17.97 22.99,16.7 26.8,12.89 40.77,12.89 41.72,13.84 v51.56,13.84
N$1
  Top 0.254: C33.2 37.53,47.94 37.59,48.01 37.59,48.26 | 37.59,48.26 IC1.2 | R2.1 37.68,48.35 37.59,48.26
N$2
  Top 0.254: IC1.1 36.32,48.86 C33.1 34.99,47.94 34.8,47.75 32.77,47.75 32.51,47.5 32.51,46.82 R1.1
N$3  (2 unrouted)
N$5  (2 unrouted)
OUT0
  Top 0.254: SV1.1 62.67,52.26 53.78,57.34 IC2.13 IC2.14
OUT1  (via drill 0.33)
  Top 0.254: v44.9,57.34 37.59,57.34 IC1.13 IC1.14
  Bottom 0.254: SV1.2 64.58,52.9 62.67,52.9 62.04,52.26 v44.9,57.34
OUT2
  Top 0.254: IC2.9 IC2.8 60.13,54.17 SV1.3
OUT3  (via drill 0.33)
  Top 0.254: v44.9,55.44 44,55.44 IC1.8 IC1.9
  Bottom 0.254: SV1.4 64.58,50.35 v44.9,55.44
OUT4  (via drill 0.33)  (2 unrouted)
  Top 0.254: v44.9,50.35 44,50.35
  Bottom 0.254: SV1.5 62.04,45.28 v44.9,50.35
OUT5
  Top 0.254: SV1.6 64.58,47.82 61.4,52.9 60.13,51.63 IC2.7 IC2.6
OUT6  (via drill 0.33)  (1 unrouted)
  Top 0.254: R1.2 38.71,46.8 R2.2
  Bottom 0.254: SV1.7 62.36,44.01 61.72,43.37 v44.9,48.45
OUT7
  Top 0.254: SV1.8 64.58,45.28 62.67,45.28 60.77,48.45 53.78,48.45 IC2.2 IC2.1
OUT8
  Top 0.254: IC4.14 IC4.13 53.78,42.1 62.67,42.1 SV1.9
OUT9  (via drill 0.33)
  Top 0.254: v44.9,42.1 37.59,42.1 IC3.13 IC3.14
  Bottom 0.254: SV1.10 64.58,42.74 62.67,42.74 62.04,42.1 v44.9,42.1
OUT10
  Top 0.254: IC4.9 IC4.8 60.13,38.92 SV1.11
OUT11  (via drill 0.33)
  Top 0.254: v44.9,40.2 44,40.2 arc-90 IC3.8 IC3.9
  Bottom 0.254: SV1.12 64.58,40.2 v44.9,40.2
OUT12  (via drill 0.33)
  Top 0.254: IC3.6 IC3.7 44,35.12 v44.9,35.12
  Bottom 0.254: SV1.13 62.04,35.12 v44.9,35.12
OUT13
  Top 0.254: IC4.6 IC4.7 60.13,36.39 61.4,37.66 64.58,37.66 SV1.14
OUT14  (via drill 0.33)
  Top 0.254: IC3.1 IC3.2 37.59,33.21 v44.9,33.21
  Bottom 0.254: SV1.15 62.36,33.85 61.72,33.21 v44.9,33.21
OUT15
  Top 0.254: IC4.1 IC4.2 53.78,33.21 60.77,33.21 62.67,35.12 64.58,35.12 SV1.16
OUT16
  Top 0.254: IC6.14 IC6.13 53.78,31.94 62.67,31.94 SV1.17
OUT17  (via drill 0.33)
  Top 0.254: IC5.14 IC5.13 37.59,31.94 v44.9,31.94
  Bottom 0.254: SV1.18 64.58,32.58 62.67,32.58 62.04,31.94 v44.9,31.94
OUT18
  Top 0.254: IC6.9 IC6.8 60.13,28.77 SV1.19
OUT19  (via drill 0.33)
  Top 0.254: IC5.9 IC5.8 44,30.04 v44.9,30.04
  Bottom 0.254: SV1.20 64.58,30.04 v44.9,30.04
OUT20  (via drill 0.33)
  Top 0.254: IC5.6 IC5.7 44,24.96 v44.9,24.96
  Bottom 0.254: SV1.21 62.04,24.96 v44.9,24.96
OUT21
  Top 0.254: IC6.6 IC6.7 60.13,26.23 61.4,27.5 64.58,27.5 SV1.22
OUT22  (via drill 0.33)
  Top 0.254: IC5.1 IC5.2 37.59,23.05 v44.9,23.05
  Bottom 0.254: SV1.23 62.36,23.69 61.72,23.05 v44.9,23.05
OUT23
  Top 0.254: IC6.1 IC6.2 53.78,23.05 60.77,23.05 62.67,24.96 64.58,24.96 SV1.24
OUT24
  Top 0.254: IC8.14 IC8.13 53.78,21.78 62.67,21.78 SV1.25
OUT25  (via drill 0.33)
  Top 0.254: IC7.14 IC7.13 37.59,21.78 v44.9,21.78
  Bottom 0.254: SV1.26 64.58,22.42 62.67,22.42 62.04,21.78 v44.9,21.78
OUT26
  Top 0.254: IC8.9 IC8.8 60.13,18.61 SV1.27
OUT27  (via drill 0.33)
  Top 0.254: IC7.9 IC7.8 44,19.88 v44.9,19.88
  Bottom 0.254: SV1.28 64.58,19.88 v44.9,19.88
OUT28  (via drill 0.33)
  Top 0.254: IC7.6 IC7.7 44,14.8 v44.9,14.8
  Bottom 0.254: SV1.29 62.04,14.8 v44.9,14.8
OUT29
  Top 0.254: IC8.6 IC8.7 60.13,16.07 61.4,17.34 64.58,17.34 SV1.30
OUT30  (via drill 0.33)
  Top 0.254: IC7.1 IC7.2 37.59,12.89 v44.9,12.89
  Bottom 0.254: SV1.31 62.04,13.53 61.4,12.89 v44.9,12.89
OUT31
  Top 0.254: IC8.1 IC8.2 53.78,12.89 60.77,12.89 62.67,14.8 64.58,14.8 SV1.32
V+  (via drill 0.33)  (3 unrouted)
  Top 0.406: v29.02,52.26 28.38,51.63 28.38,37.02 | 28.38,37.02 v28.38,32.58 28.38,29.4 29.02,28.77 v29.02,26.86 28.38,26.23 v28.38,16.7 v28.38,12.26 29.65,10.99 SV1.33 | v29.02,37.02 28.38,37.02 | IC1.4 v40.13,51.94 | IC2.4 v56.33,51.94 | IC4.4 v56.33,36.7 | v40.13,36.7 IC3.4 | v40.13,26.54 IC5.4 | IC6.4 v56.33,26.54 | IC8.4 v56.33,16.38 | IC7.4 v40.13,16.38
  Bottom 0.406: 55.27,47.18 40.13,47.18 | v29.02,52.26 39.08,47.18 | v56.33,36.7 56.33,37.02 55.37,37.02 | 55.37,37.02 40.13,37.02 | 39.18,37.02 38.54,37.02 | 38.54,37.02 v29.02,37.02 | v56.33,26.54 56.33,26.86 55.05,26.86 | 55.05,26.86 40.13,26.86 | 39.18,26.86 v29.02,26.86 | v56.33,16.38 56.33,16.7 55.37,16.7 | 55.37,16.7 40.13,16.7 | 39.08,16.7 v28.38,16.7 | v28.38,32.58 15.53,32.58 15.53,35.59 | v40.13,51.94 40.13,47.18 | 40.13,47.18 39.08,47.18 | 39.08,47.18 C48.2 | v56.33,51.94 56.33,47.18 55.27,47.18 | 55.27,47.18 C52.2 | C53.2 55.16,36.81 55.37,37.02 | 38.54,37.02 38.76,36.81 C49.2 38.97,36.81 39.18,37.02 | 39.18,37.02 40.13,37.02 | 40.13,37.02 v40.13,36.7 | C50.2 38.97,26.64 39.18,26.86 | 39.18,26.86 40.13,26.86 | 40.13,26.86 v40.13,26.54 | C54.2 55.05,26.86 | C55.2 55.16,16.48 55.37,16.7 | v40.13,16.38 40.13,16.7 | 40.13,16.7 39.08,16.7 | 39.08,16.7 C51.2 | 15.53,35.59 15.53,35.75 C57.2 | C57.2 v13.14,35.75 | 13.78,15.43 v13.14,15.43 13.08,15.49 10.92,13.46 | 13.78,12.26 v28.38,12.26 | J1.1 13.78,12.26 | 13.78,12.26 13.78,15.43 | 13.78,15.43 C56.2 | C57.2 15.47,35.65 15.53,35.59
V-  (via drill 0.33)  (5 unrouted)
  Top 0.406: v28.38,53.53 27.11,52.26 v27.11,38.29 27.11,28.13 | 27.11,28.13 v27.11,17.97 27.11,10.67 29.34,8.45 SV1.35 | 27.11,28.13 v28.07,28.13 | IC3.11 v40.13,38.61 | IC1.11 v40.13,53.85 | IC2.11 v56.33,53.85 | v56.33,38.61 IC4.11 | IC5.11 v40.13,28.45 | v56.33,28.45 IC6.11 | IC8.11 v56.33,18.29 | v40.13,18.29 IC7.11 | J1.3 18.86,12.19 | 18.86,12.19 v18.86,15.43 | 18.86,34.48 v18.86,35.75 | v11.68,12.19 18.86,12.19
  Bottom 0.406: 39.08,48.45 v28.38,53.53 | 40.13,48.45 55.27,48.45 | 39.08,38.29 v27.11,38.29 | v56.33,28.45 56.33,28.13 55.05,28.13 | 55.05,28.13 40.13,28.13 | 40.13,28.13 38.86,28.13 | 38.86,28.13 v28.07,28.13 | v56.33,18.29 56.33,17.97 55.05,17.97 | 55.05,17.97 40.13,17.97 | 38.86,17.97 v27.11,17.97 | v40.13,38.61 40.13,38.29 | 40.13,38.29 39.08,38.29 | 39.08,38.29 C49.1 | v40.13,53.85 40.13,48.45 | 40.13,48.45 39.08,48.45 | 39.08,48.45 C48.1 | v56.33,53.85 56.33,48.45 55.27,48.45 | 55.27,48.45 C52.1 | 40.13,38.29 55.37,38.29 | 55.37,38.29 56.33,38.29 v56.33,38.61 | C53.1 55.16,38.51 55.37,38.29 | v40.13,28.45 40.13,28.13 | C50.1 38.86,28.13 | C54.1 55.05,28.13 | C55.1 55.05,17.97 | C51.1 38.86,17.97 | 38.86,17.97 40.13,17.97 | 40.13,17.97 v40.13,18.29 | v18.86,15.43 C56.1 | v18.86,35.75 C57.1 | 3.3,12.19 v11.68,12.19
VOUT1  (via drill 0.33)  (1 unrouted)
  Top 0.254: v11.18,33.02 11.18,34.37 IC9.28 | DACS.3 8.29,22.45 7.62,23.11 5.33,23.11 4.57,22.35 4.57,16.26 5.84,14.99 5.84,9.65
  Bottom 0.254: DACS.3 8.29,31.66 9.65,33.02 v11.18,33.02
VOUT2  (1 unrouted)
  Top 0.254: 3.3,9.65 3.3,20.13 DACS.1
VOUT-JMP
  Top 0.254: DACS.2 5.75,18.13 9.65,14.22 11.23,14.22 IC10.28